# EAGLE design ControlBoardV2_PRO (EAGLE 9.6.2)
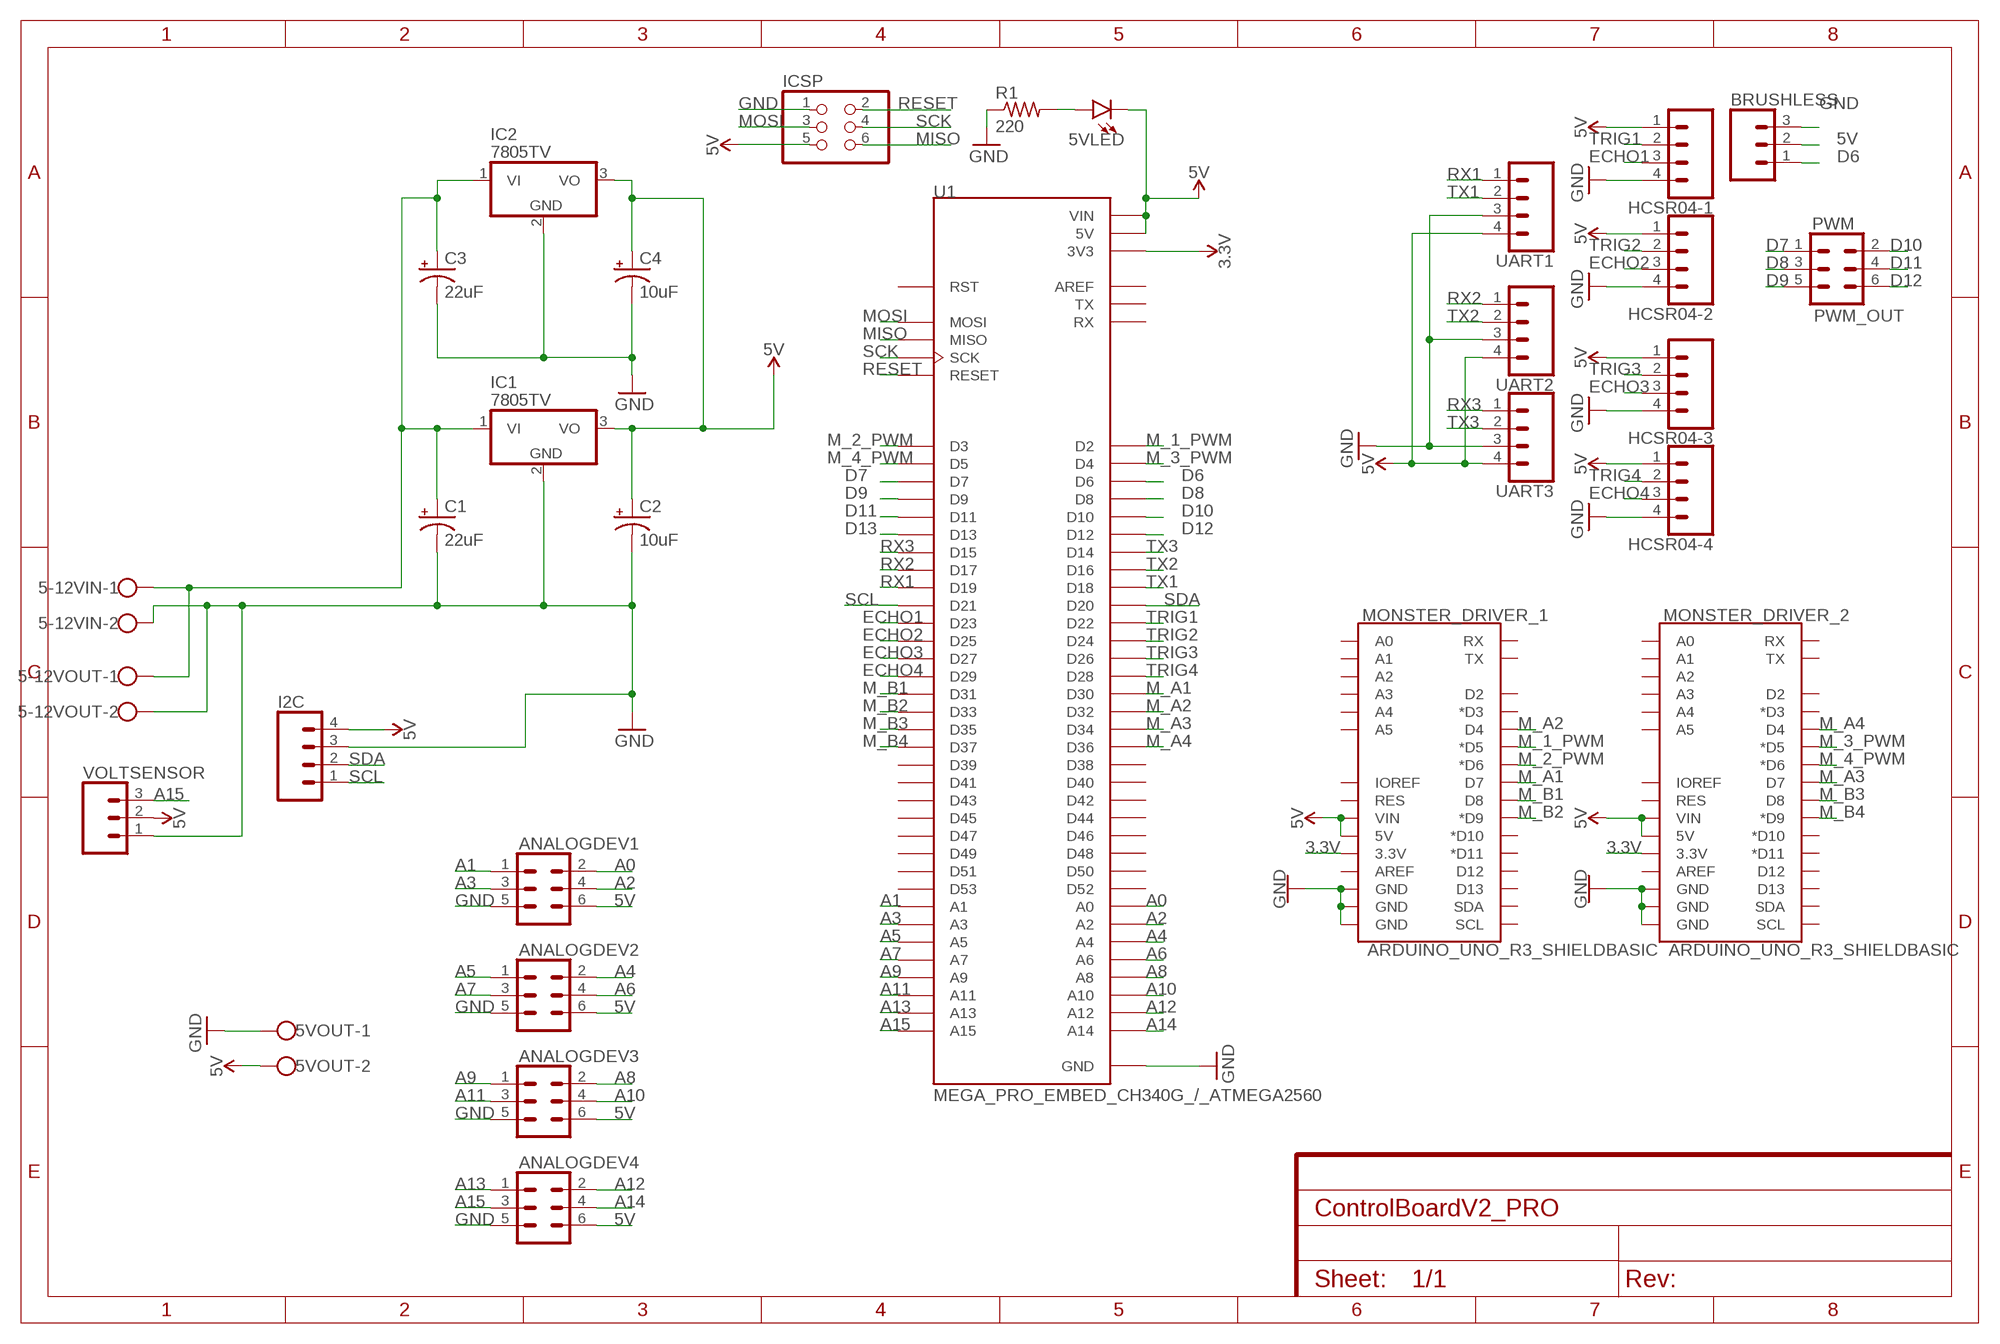
[diagram p0: schematic, sheet 1]

## Parts
5-12VIN  W237-102  [W237-102]
5-12VOUT  W237-102  [W237-102]
5VLED  LED5MM  [LED_5MM]
5VOUT  W237-102  [W237-102]
ANALOGDEV1  CONN_03X2NO_SILK  [2X3-NS]
ANALOGDEV2  CONN_03X2NO_SILK  [2X3-NS]
ANALOGDEV3  CONN_03X2NO_SILK  [2X3-NS]
ANALOGDEV4  CONN_03X2NO_SILK  [2X3-NS]
BRUSHLESS  CONN_03  [1X03]
C1  22uF  CPOL-USE2.5-5  [E2,5-5]
C2  10uF  CPOL-USE2.5-5  [E2,5-5]
C3  22uF  CPOL-USE2.5-5  [E2,5-5]
C4  10uF  CPOL-USE2.5-5  [E2,5-5]
HCSR04-1  CONN_04  [1X04]
HCSR04-2  CONN_04  [1X04]
HCSR04-3  CONN_04  [1X04]
HCSR04-4  CONN_04  [1X04]
I2C  CONN_04  [1X04]
IC1  7805TV  [TO220V]
IC2  7805TV  [TO220V]
ICSP  PINHD-2X3  [2X03]
MONSTER_DRIVER_1  ARDUINO_UNO_R3_SHIELDBASIC  [UNO_R3_SHIELD]
MONSTER_DRIVER_2  ARDUINO_UNO_R3_SHIELDBASIC  [UNO_R3_SHIELD]
PWM  PWM_OUT  CONN_03X2FEMALE  [2X3]
R1  220  R-US_0204/7  [0204/7]
U1  MEGA_PRO_EMBED_CH340G_/_ATMEGA2560  [MODULE_MEGA_PRO_EMBED_CH340G_/_ATMEGA2560]
UART1  CONN_04  [1X04]
UART2  CONN_04  [1X04]
UART3  CONN_04  [1X04]
VOLTSENSOR  CONN_03  [1X03]

## Nets
3.3V: MONSTER_DRIVER_1.3.3V MONSTER_DRIVER_2.3.3V U1.3V3_1(3V3) U1.3V3_2(3V3)
5V: 5VLED.K(C) 5VOUT.2 ANALOGDEV1.6 ANALOGDEV2.6 ANALOGDEV3.6 ANALOGDEV4.6 BRUSHLESS.2 C2.+ C4.+ HCSR04-1.1 HCSR04-2.1 HCSR04-3.1 HCSR04-4.1 I2C.4 IC1.3(VO) IC2.3(VO) ICSP.5 MONSTER_DRIVER_1.5V MONSTER_DRIVER_1.VIN MONSTER_DRIVER_2.5V MONSTER_DRIVER_2.VIN U1.5V_1(5V) U1.5V_2(5V) U1.5V_3(5V) U1.VIN_1(VIN) U1.VIN_2(VIN) UART1.4 UART2.4 UART3.4 VOLTSENSOR.2
A0: ANALOGDEV1.2 U1.A0
A1: ANALOGDEV1.1 U1.A1
A2: ANALOGDEV1.4 U1.A2
A3: ANALOGDEV1.3 U1.A3
A4: ANALOGDEV2.2 U1.A4
A5: ANALOGDEV2.1 U1.A5
A6: ANALOGDEV2.4 U1.A6
A7: ANALOGDEV2.3 U1.A7
A8: ANALOGDEV3.2 U1.A8
A9: ANALOGDEV3.1 U1.A9
A10: ANALOGDEV3.4 U1.A10
A11: ANALOGDEV3.3 U1.A11
A12: ANALOGDEV4.2 U1.A12
A13: ANALOGDEV4.1 U1.A13
A14: ANALOGDEV4.4 U1.A14
A15: ANALOGDEV4.3 U1.A15 VOLTSENSOR.3
D6: BRUSHLESS.1 U1.D6
D7: PWM.1 U1.D7
D8: PWM.3 U1.D8
D9: PWM.5 U1.D9
D10: PWM.2 U1.D10
D11: PWM.4 U1.D11
D12: PWM.6 U1.D12
D13: U1.D13
ECHO1: HCSR04-1.3 U1.D23
ECHO2: HCSR04-2.3 U1.D25
ECHO3: HCSR04-3.3 U1.D27
ECHO4: HCSR04-4.3 U1.D29
GND: 5-12VIN.2 5-12VOUT.2 5VOUT.1 ANALOGDEV1.5 ANALOGDEV2.5 ANALOGDEV3.5 ANALOGDEV4.5 BRUSHLESS.3 C1.- C2.- C3.- C4.- HCSR04-1.4 HCSR04-2.4 HCSR04-3.4 HCSR04-4.4 I2C.3 IC1.2(GND) IC2.2(GND) ICSP.1 MONSTER_DRIVER_1.GND@0(GND) MONSTER_DRIVER_1.GND@1(GND) MONSTER_DRIVER_1.GND@2(GND) MONSTER_DRIVER_2.GND@0(GND) MONSTER_DRIVER_2.GND@1(GND) MONSTER_DRIVER_2.GND@2(GND) R1.1 U1.GND_1(GND) U1.GND_2(GND) U1.GND_3(GND) UART1.3 UART2.3 UART3.3 VOLTSENSOR.1
M_1_PWM: MONSTER_DRIVER_1.D5(*D5) U1.D2
M_2_PWM: MONSTER_DRIVER_1.D6(*D6) U1.D3
M_3_PWM: MONSTER_DRIVER_2.D5(*D5) U1.D4
M_4_PWM: MONSTER_DRIVER_2.D6(*D6) U1.D5
M_A1: MONSTER_DRIVER_1.D7 U1.D30
M_A2: MONSTER_DRIVER_1.D4 U1.D32
M_A3: MONSTER_DRIVER_2.D7 U1.D34
M_A4: MONSTER_DRIVER_2.D4 U1.D36
M_B1: MONSTER_DRIVER_1.D8 U1.D31
M_B2: MONSTER_DRIVER_1.D9(*D9) U1.D33
M_B3: MONSTER_DRIVER_2.D8 U1.D35
M_B4: MONSTER_DRIVER_2.D9(*D9) U1.D37
MISO: ICSP.6 U1.MISO
MOSI: ICSP.3 U1.MOSI
N$2: 5VLED.A R1.2
N$11: 5-12VIN.1 5-12VOUT.1 C1.+ C3.+ IC1.1(VI) IC2.1(VI)
RESET: ICSP.2 U1.RESET
RX1: U1.D19 UART1.1
RX2: U1.D17 UART2.1
RX3: U1.D15 UART3.1
SCK: ICSP.4 U1.SCK
SCL: I2C.1 U1.D21
SDA: I2C.2 U1.D20
TRIG1: HCSR04-1.2 U1.D22
TRIG2: HCSR04-2.2 U1.D24
TRIG3: HCSR04-3.2 U1.D26
TRIG4: HCSR04-4.2 U1.D28
TX1: U1.D18 UART1.2
TX2: U1.D16 UART2.2
TX3: U1.D14 UART3.2
Unconnected: MONSTER_DRIVER_1.A0 MONSTER_DRIVER_1.A1 MONSTER_DRIVER_1.A2 MONSTER_DRIVER_1.A3 MONSTER_DRIVER_1.A4 MONSTER_DRIVER_1.A5 MONSTER_DRIVER_1.AREF MONSTER_DRIVER_1.D2 MONSTER_DRIVER_1.D3(*D3) MONSTER_DRIVER_1.D10(*D10) MONSTER_DRIVER_1.D11(*D11) MONSTER_DRIVER_1.D12 MONSTER_DRIVER_1.D13 MONSTER_DRIVER_1.IOREF MONSTER_DRIVER_1.RES MONSTER_DRIVER_1.RX MONSTER_DRIVER_1.SCL MONSTER_DRIVER_1.SDA MONSTER_DRIVER_1.TX MONSTER_DRIVER_2.A0 MONSTER_DRIVER_2.A1 MONSTER_DRIVER_2.A2 MONSTER_DRIVER_2.A3 MONSTER_DRIVER_2.A4 MONSTER_DRIVER_2.A5 MONSTER_DRIVER_2.AREF MONSTER_DRIVER_2.D2 MONSTER_DRIVER_2.D3(*D3) MONSTER_DRIVER_2.D10(*D10) MONSTER_DRIVER_2.D11(*D11) MONSTER_DRIVER_2.D12 MONSTER_DRIVER_2.D13 MONSTER_DRIVER_2.IOREF MONSTER_DRIVER_2.RES MONSTER_DRIVER_2.RX MONSTER_DRIVER_2.SCL MONSTER_DRIVER_2.SDA MONSTER_DRIVER_2.TX U1.AREF U1.D38 U1.D39 U1.D40 U1.D41 U1.D42 U1.D43 U1.D44 U1.D45 U1.D46 U1.D47 U1.D48 U1.D49 U1.D50 U1.D51 U1.D52 U1.D53 U1.RST U1.RX U1.TX

## Library data of the parts
5-12VIN 5-12VOUT 5VOUT = con-wago-500:W237-102: WAGO SCREW CLAMP; MPN: 237-102; OC_FARNELL: unknown; OC_NEWARK: 70K9898
5VLED = SparkFun-LED:LED: LED (Generic) Standard schematic elements and footprints for 5mm, 3mm, 1206, and 0603 sized LEDs. Generic LEDs with no color specified.
ANALOGDEV1-ANALOGDEV4 = SparkFun-Connectors:CONN_03X2: Multi connection point. Often used as Generic Header-pin footprint for 0.1 inch spaced/style header connections You can populate with any combo of single row headers, but if you'd like an exact match, check these: Header - 2x3 (Male, 0.1") <https://www.sparkfun.com/products/12807> (PRT-12807) Header - 2x3 (Female, 0.1") <https://www.sparkfun.com/products/13010> (PRT-13010) 2x3 Pin Shrouded Header <https://www.sparkfun.com/products/10877> (PRT-10877) On any of the 0.1 inch spaced packages, you can populate with these: Break Away Headers - Straight <https://www.sparkfun.com/products/116> (PRT-00116) Break Away Male Headers - Right Angle <https://www.sparkfun.com/products/553> (PRT-00553) Female Headers <https://www.sparkfun.com/products/115> (PRT-00115) Break Away Headers - Machine Pin <https://www.sparkfun.com/products/117> (PRT-00117) Break Away Female Headers - Swiss Machine Pin <https://www.sparkfun.com/products/743> (PRT-00743) Special note: the shrouded connector mates well with our 3x2 ribbon cables: Ribbon Crimp Connector - 6-pin (2x3, Female) <https://www.sparkfun.com/products/10651> (PRT-10651) Ribbon Cable - 6 wire (15ft) <https://www.sparkfun.com/products/10646> (PRT-10646)
BRUSHLESS = SparkFun-Connectors:CONN_03: Multi connection point. Often used as Generic Header-pin footprint for 0.1 inch spaced/style header connections On any of the 0.1 inch spaced packages, you can populate with these: Break Away Headers - Straight <https://www.sparkfun.com/products/116> (PRT-00116) Break Away Male Headers - Right Angle <https://www.sparkfun.com/products/553> (PRT-00553) Female Headers <https://www.sparkfun.com/products/115> (PRT-00115) Break Away Headers - Machine Pin <https://www.sparkfun.com/products/117> (PRT-00117) Break Away Female Headers - Swiss Machine Pin <https://www.sparkfun.com/products/743> (PRT-00743) Stackable Header - 3 Pin (Female, 0.1") <https://www.sparkfun.com/products/13875> (PRT-13875) For SCREWTERMINALS and SPRING TERMINALS visit here: Screw Terimnals on SparkFun.com <https://www.sparkfun.com/search/results?term=Screw+Terminals> (5mm/3.5mm/2.54mm spacing) This device is also useful as a general connection point to wire up your design to another part of your project. Our various solder wires solder well into these plated through hole pads. Hook-Up Wire - Assortment (Stranded, 22 AWG) <https://www.sparkfun.com/products/11375> (PRT-11375) Hook-Up Wire - Assortment (Solid Core, 22 AWG) <https://www.sparkfun.com/products/11367> (PRT-11367) View the entire wire category on our website here <https://www.sparkfun.com/categories/141> Special notes: Molex polarized connector foot print use with SKU : PRT-08232 with associated crimp pins and housings.; PROD_ID: XXX-00000; VALUE: 455-1750-1-ND
C1-C4 = adafruit:CPOL-US: POLARIZED CAPACITOR, American symbol
HCSR04-1-HCSR04-4 I2C UART1-UART3 = SparkFun-Connectors:CONN_04: Multi connection point. Often used as Generic Header-pin footprint for 0.1 inch spaced/style header connections On any of the 0.1 inch spaced packages, you can populate with these: Break Away Headers - Straight <https://www.sparkfun.com/products/116> (PRT-00116) Break Away Male Headers - Right Angle <https://www.sparkfun.com/products/553> (PRT-00553) Female Headers <https://www.sparkfun.com/products/115> (PRT-00115) Break Away Headers - Machine Pin <https://www.sparkfun.com/products/117> (PRT-00117) Break Away Female Headers - Swiss Machine Pin <https://www.sparkfun.com/products/743> (PRT-00743) For SCREWTERMINALS and SPRING TERMINALS visit here: Screw Terimnals on SparkFun.com <https://www.sparkfun.com/search/results?term=Screw+Terminals> (5mm/3.5mm/2.54mm spacing) This device is also useful as a general connection point to wire up your design to another part of your project. Our various solder wires solder well into these plated through hole pads. Hook-Up Wire - Assortment (Stranded, 22 AWG) <https://www.sparkfun.com/products/11375> (PRT-11375) Hook-Up Wire - Assortment (Solid Core, 22 AWG) <https://www.sparkfun.com/products/11367> (PRT-11367) View the entire wire category on our website here <https://www.sparkfun.com/categories/141> Special notes: Molex polarized connector foot print use with SKU : PRT-08231 with associated crimp pins and housings. 1MM SMD Version SKU: PRT-10208; PROD_ID: CONN-09696
IC1 IC2 = linear:78*: Positive VOLTAGE REGULATOR Source: http://cache.national.com/ds/LM/LM78L05.pdf http://www.fairchildsemi.com/ds/LM/LM7805.pdf
ICSP = pinhead:PINHD-2X3: PIN HEADER
MONSTER_DRIVER_1 MONSTER_DRIVER_2 = SparkFun-Boards:ARDUINO_UNO_R3_SHIELD: Arduino R3 Shield Footprint Shield form compatible with the Arduino Uno R3. SparkFun Products: MG2639 Cellular Shield <https://www.sparkfun.com/products/13120> MIDI Shield <https://www.sparkfun.com/products/12898> R3 Stackable Headers Kit <https://www.sparkfun.com/products/11417>
PWM = SparkFun-Connectors:CONN_03X2: Multi connection point. Often used as Generic Header-pin footprint for 0.1 inch spaced/style header connections You can populate with any combo of single row headers, but if you'd like an exact match, check these: Header - 2x3 (Male, 0.1") <https://www.sparkfun.com/products/12807> (PRT-12807) Header - 2x3 (Female, 0.1") <https://www.sparkfun.com/products/13010> (PRT-13010) 2x3 Pin Shrouded Header <https://www.sparkfun.com/products/10877> (PRT-10877) On any of the 0.1 inch spaced packages, you can populate with these: Break Away Headers - Straight <https://www.sparkfun.com/products/116> (PRT-00116) Break Away Male Headers - Right Angle <https://www.sparkfun.com/products/553> (PRT-00553) Female Headers <https://www.sparkfun.com/products/115> (PRT-00115) Break Away Headers - Machine Pin <https://www.sparkfun.com/products/117> (PRT-00117) Break Away Female Headers - Swiss Machine Pin <https://www.sparkfun.com/products/743> (PRT-00743) Special note: the shrouded connector mates well with our 3x2 ribbon cables: Ribbon Crimp Connector - 6-pin (2x3, Female) <https://www.sparkfun.com/products/10651> (PRT-10651) Ribbon Cable - 6 wire (15ft) <https://www.sparkfun.com/products/10646> (PRT-10646); PROD_ID: CONN-11566; VALUE: FEMALE 2x3
R1 = adafruit:R-US_: RESISTOR, American symbol
U1 = MEGA_PRO_EMBED_CH340G___ATMEGA2560:MEGA_PRO_EMBED_CH340G_/_ATMEGA2560: Mega 2560 PRO (Embed) CH340G/ATmega2560-16AU Check availability <https://pricing.snapeda.com/parts/Mega%20Pro%20Embed%20CH340G%20/%20ATmega2560/Robotdyn/view-part?ref=eda>; AVAILABILITY: Not in stock; MF: Robotdyn; MP: Mega Pro Embed CH340G / ATmega2560; PACKAGE: None; PRICE: None
VOLTSENSOR = SparkFun-Connectors:CONN_03: Multi connection point. Often used as Generic Header-pin footprint for 0.1 inch spaced/style header connections On any of the 0.1 inch spaced packages, you can populate with these: Break Away Headers - Straight <https://www.sparkfun.com/products/116> (PRT-00116) Break Away Male Headers - Right Angle <https://www.sparkfun.com/products/553> (PRT-00553) Female Headers <https://www.sparkfun.com/products/115> (PRT-00115) Break Away Headers - Machine Pin <https://www.sparkfun.com/products/117> (PRT-00117) Break Away Female Headers - Swiss Machine Pin <https://www.sparkfun.com/products/743> (PRT-00743) Stackable Header - 3 Pin (Female, 0.1") <https://www.sparkfun.com/products/13875> (PRT-13875) For SCREWTERMINALS and SPRING TERMINALS visit here: Screw Terimnals on SparkFun.com <https://www.sparkfun.com/search/results?term=Screw+Terminals> (5mm/3.5mm/2.54mm spacing) This device is also useful as a general connection point to wire up your design to another part of your project. Our various solder wires solder well into these plated through hole pads. Hook-Up Wire - Assortment (Stranded, 22 AWG) <https://www.sparkfun.com/products/11375> (PRT-11375) Hook-Up Wire - Assortment (Solid Core, 22 AWG) <https://www.sparkfun.com/products/11367> (PRT-11367) View the entire wire category on our website here <https://www.sparkfun.com/categories/141> Special notes: Molex polarized connector foot print use with SKU : PRT-08232 with associated crimp pins and housings.

## Board
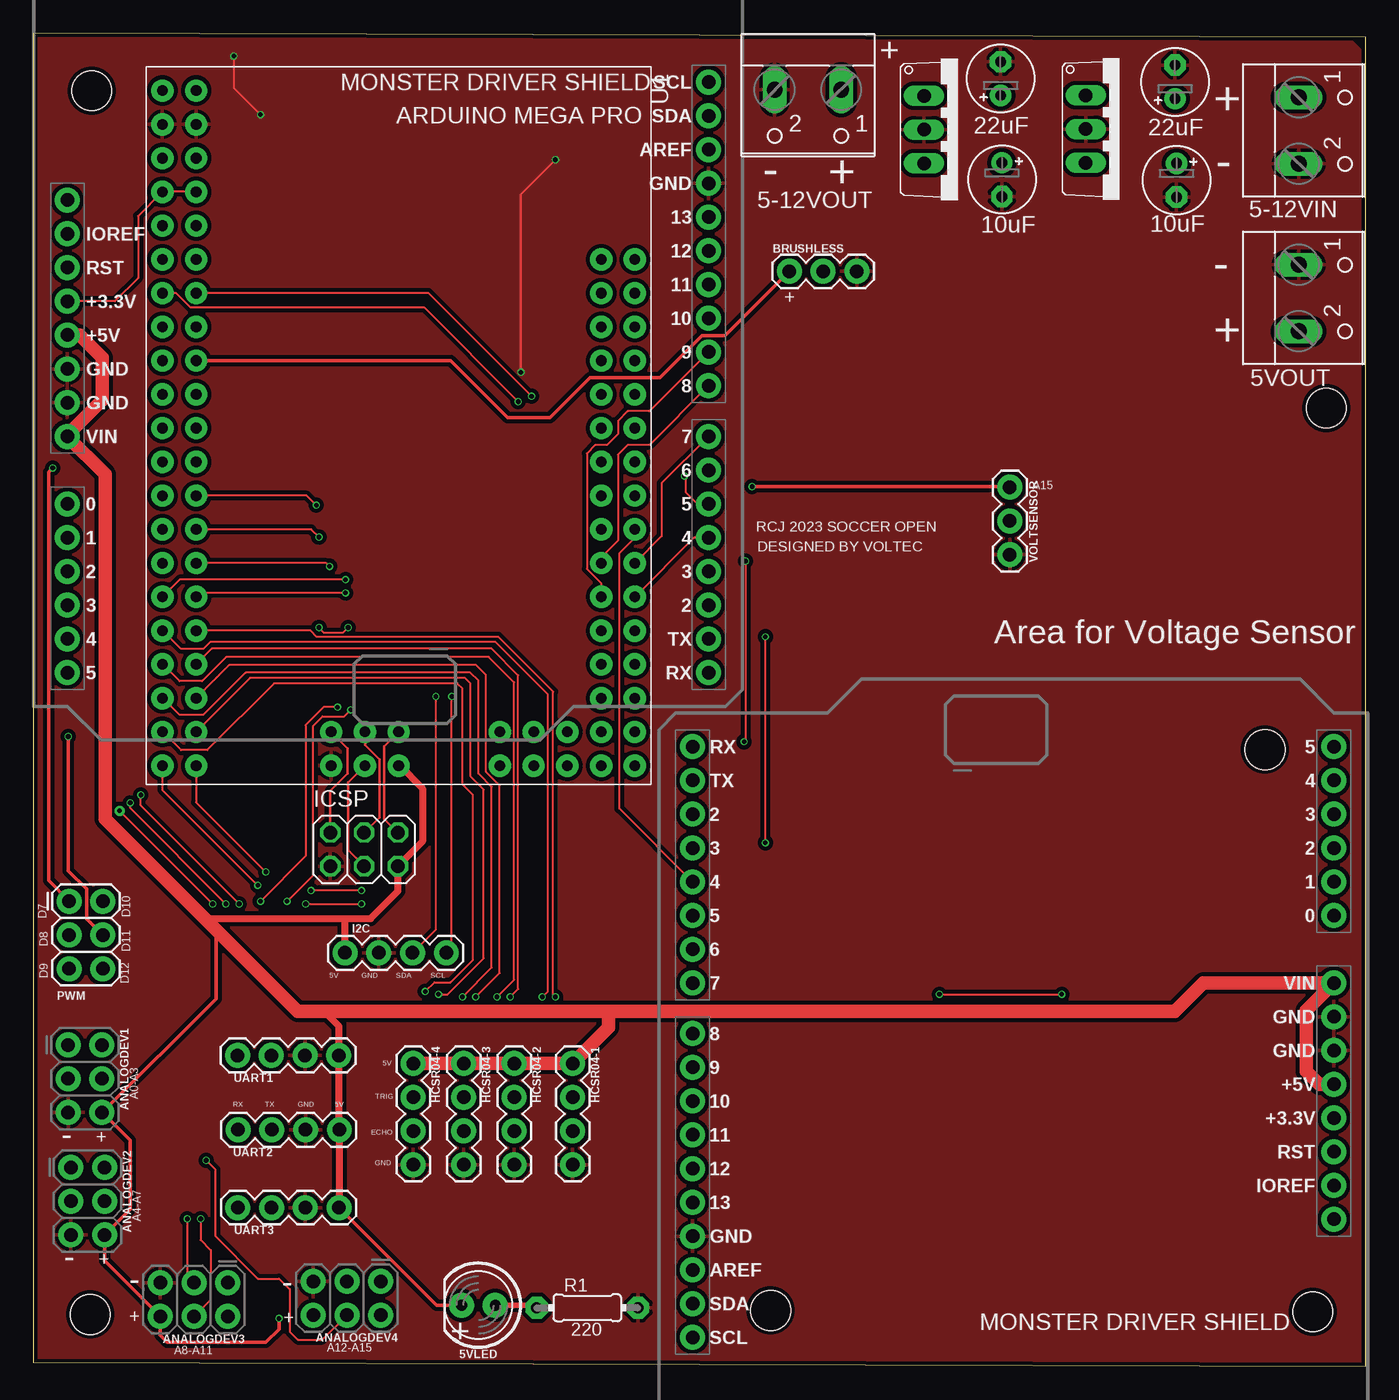
[diagram p1: board, top side]
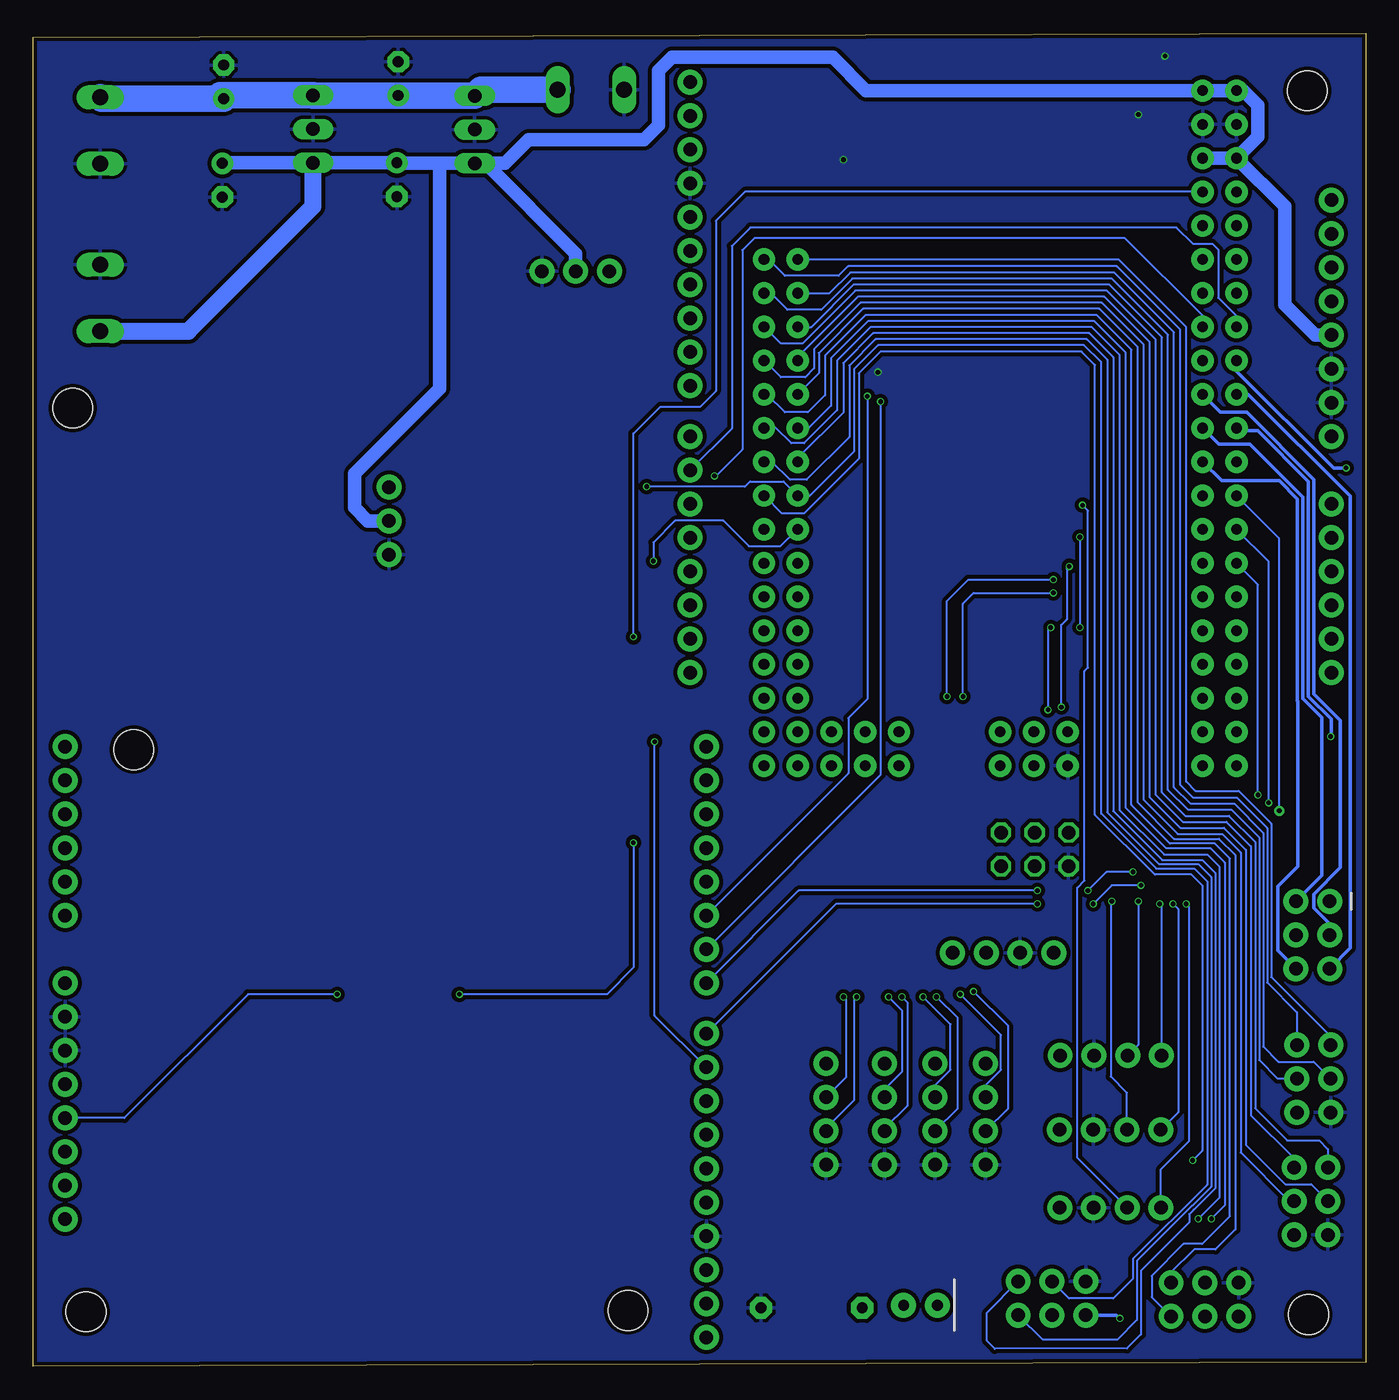
[diagram p2: board, bottom side, seen from below]

Size 100.27 x 100.32 mm. Coordinates in mm from the lower left corner, seen from the top.
Outline: 0,0.3 100.27,0 100.27,100.02 0,100.32 0,0.3
Copper layers (1*16): Top 0.035559375mm / dielectric 1.6mm / Bottom 0.035559375mm
Design rules "jlcpcb2layer": minimum track width 5mil, minimum drill 12mil, track to track 5mil, track to pad 5mil, pad to pad 5mil, via to via 5mil, smd to smd 5mil, copper to edge 8mil, drill to drill 6mil, minimum pad ring 5mil, minimum via ring 3mil, stop-mask expansion 2.5mil, vias tented up to drill 0mil, thermal gap 10mil
Holes 3 mm at 4.4,96 96.3,4.1 55.5,4.2 92.7,46.4 4.3,3.9 97.3,72.1

### Footprints (pad centres in the part's own frame; a part is rotated, then mirrored left to right if it is on the bottom)
W237-102 = drill 1.194 long: 1 -2.5,-1.27; 2 2.5,-1.27
LED_5MM = drill 0.813 pad 1.88: A -1.27,0; K 1.27,0
2X3-NS = drill 1.016 pad 1.88: 1 -2.54,-1.27; 2 -2.54,1.27; 3 0,-1.27; 4 0,1.27; 5 2.54,-1.27; 6 2.54,1.27
1X03 = drill 1.016 pad 1.88: 1 0,0; 2 2.54,0; 3 5.08,0
E2,5-5 = drill 0.813 pad 1.6: + -1.27,0 | drill 0.813 pad 1.6 octagon: - 1.27,0
1X04 = drill 1.016 pad 1.88: 1 0,0; 2 2.54,0; 3 5.08,0; 4 7.62,0
TO220V = drill 1.016 long: 1 -2.54,-2.54; 2 0,-2.54; 3 2.54,-2.54
2X03 = drill 1.016 octagon: 1 -2.54,-1.27; 2 -2.54,1.27; 3 0,-1.27; 4 0,1.27; 5 2.54,-1.27; 6 2.54,1.27
UNO_R3_SHIELD = drill 1.016 pad 1.88: 3.3V 24.13,-2.54; 5V 24.13,0; A0 24.13,12.7; A1 24.13,15.24; A2 24.13,17.78; A3 24.13,20.32; A4 24.13,22.86; A5 24.13,25.4; AREF -24.13,-13.97; D2 -24.13,20.32; D3 -24.13,17.78; D4 -24.13,15.24; D5 -24.13,12.7; D6 -24.13,10.16; D7 -24.13,7.62; D8 -24.13,3.81; D9 -24.13,1.27; D10 -24.13,-1.27; D11 -24.13,-3.81; D12 -24.13,-6.35; D13 -24.13,-8.89; GND@0 24.13,2.54; GND@1 24.13,5.08; GND@2 -24.13,-11.43; IOREF 24.13,-7.62; NC 24.13,-10.16; RES 24.13,-5.08; RX -24.13,25.4; SCL -24.13,-19.05; SDA -24.13,-16.51; TX -24.13,22.86; VIN 24.13,7.62
2X3 = drill 1.016 pad 1.88: 1 0,0; 2 0,2.54; 3 2.54,0; 4 2.54,2.54; 5 5.08,0; 6 5.08,2.54
0204/7 = drill 0.813 pad 1.676 octagon: 1 -3.81,0; 2 3.81,0
MODULE_MEGA_PRO_EMBED_CH340G_/_ATMEGA2560 = drill 0.8 pad 1.676: 3V3_1 -17.58,-17.78; 3V3_2 -17.58,-15.24; 5V_1 -20.12,-17.78; 5V_2 -20.12,-15.24; 5V_3 25.6,0; A0 -12.5,17.78; A1 -12.5,15.24; A2 -9.96,17.78; A3 -9.96,15.24; A4 -7.42,17.78; A5 -7.42,15.24; A6 -4.88,17.78; A7 -4.88,15.24; A8 -2.34,17.78; A9 -2.34,15.24; A10 0.2,17.78; A11 0.2,15.24; A12 2.74,17.78; A13 2.74,15.24; A14 5.28,17.78; A15 5.28,15.24; AREF -15.04,-15.24; D2 -9.96,-15.24; D3 -9.96,-17.78; D4 -7.42,-15.24; D5 -7.42,-17.78; D6 -4.88,-15.24; D7 -4.88,-17.78; D8 -2.34,-15.24; D9 -2.34,-17.78; D10 0.2,-15.24; D11 0.2,-17.78; D12 2.74,-15.24; D13 2.74,-17.78; D14 5.28,-15.24; D15 5.28,-17.78; D16 7.82,-15.24; D17 7.82,-17.78; D18 10.36,-15.24; D19 10.36,-17.78; D20 12.9,-15.24; D21 12.9,-17.78; D22 15.44,-15.24; D23 15.44,-17.78; D24 17.98,-15.24; D25 17.98,-17.78; D26 20.52,-15.24; D27 20.52,-17.78; D28 23.06,-15.24; D29 23.06,-17.78; D30 25.6,-15.24; D31 25.6,-17.78; D32 7.82,17.78; D33 7.82,15.24; D34 10.36,17.78; D35 10.36,15.24; D36 12.9,17.78; D37 12.9,15.24; D38 15.44,17.78; D39 15.44,15.24; D40 17.98,17.78; D41 17.98,15.24; D42 20.52,17.78; D43 20.52,15.24; D44 23.06,17.78; D45 23.06,15.24; D46 25.6,17.78; D47 25.6,15.24; D48 25.6,12.7; D49 23.06,12.7; D50 25.6,10.16; D51 23.06,10.16; D52 25.6,7.62; D53 23.06,7.62; GND_1 -22.66,-17.78; GND_2 -22.66,-15.24; GND_3 25.6,-5.08; MISO 23.06,0; MOSI 25.6,-2.54; RESET 23.06,-5.08; RST -15.04,-17.78; RX -12.5,-15.24; SCK 23.06,-2.54; TX -12.5,-17.78; VIN_1 -25.2,-17.78; VIN_2 -25.2,-15.24

### Placement (x,y rotation side)
5-12VIN  96.5,93 270 top
5-12VOUT  58.3,94.8 180 top
5VLED  33.5,4.6 180 top
5VOUT  96.5,80.4 270 top
ANALOGDEV1  3.9,21.64 270 top
ANALOGDEV2  4.1,12.43 270 top
ANALOGDEV3  12.1,5.02 180 top
ANALOGDEV4  23.61,5.12 180 top
BRUSHLESS  56.9,82.4 0 top
C1  85.93,96.66 90 top
C2  86.04,89.26 270 top
C3  72.8,96.9 90 top
C4  72.9,89.3 270 top
HCSR04-1  40.6,22.79 270 top
HCSR04-2  36.2,22.79 270 top
HCSR04-3  32.4,22.79 270 top
HCSR04-4  28.6,22.79 270 top
I2C  31.09,31.11 180 top
IC1  81.75,93.11 270 top
IC2  69.58,93.07 270 top
ICSP  24.9,38.9 0 top
MONSTER_DRIVER_1  73.75,21.23 0 top
MONSTER_DRIVER_2  26.7,77.6 180 top
PWM  2.7,35 270 top
R1  41.7,4.4 180 top
U1  27.5,70.8 270 top
UART1  15.37,23.39 0 top
UART2  15.42,17.8 0 top
UART3  15.4,11.94 0 top
VOLTSENSOR  73.49,61.07 90 top

### Tracks (layer width: path | path; a pad name or v marks a point on that pad's centre or on a via)
3.3V  (via drill 0.35)
  Top 0.152: U1.3V3_2 U1.3V3_1 7.9,86.56 7.9,81.9 6.14,80.14 MONSTER_DRIVER_2.3.3V | v55.1,39.4 v55.1,54.9 | v68.2,28 v77.4,28
  Bottom 0.152: MONSTER_DRIVER_1.3.3V 93.41,18.69 84.1,28 v77.4,28 | U1.3V3_2 46.72,88.38 48.9,86.2 48.9,73.4 50.1,72.2 53.1,72.2 55.1,70.2 v55.1,54.9 | v55.1,39.4 55.1,30 57.1,28 v68.2,28
5V  (via drill 0.35)
  Top 0.254: UART3.4 30.36,4.6 5VLED.K | v18.5,3.6 18.5,2.8 17.5,1.8 10.1,1.8 9.56,2.34 ANALOGDEV3.6 5.37,7.94 ANALOGDEV2.6 7.3,11.82 7.3,17 5.2,19.1 | 5.2,19.1 ANALOGDEV1.6 | 5.2,19.1 13.75,27.65 13.75,32.85
  Top 0.508: 12.9,33.7 23.47,33.7 | 23.47,33.7 25.4,33.7 27.44,35.74 ICSP.5 29.3,39.49 29.3,43.5 27.6,45.2 | I2C.4 23.47,33.7 | 21.9,26.7 22.99,25.61 UART1.4 22.99,17.85 UART2.4 23.04,11.96 UART3.4
  Top 1.016: 27.6,45.2 U1.5V_3 | MONSTER_DRIVER_1.5V 96.77,21.23 95.8,22.2 95.8,26.77 MONSTER_DRIVER_1.VIN 88.05,28.85 85.9,26.7 43.3,26.7 | 43.3,26.7 21.9,26.7 19.9,26.7 13.75,32.85 12.9,33.7 5.4,41.2 5.4,67.15 MONSTER_DRIVER_2.VIN 2.57,70.07 5.2,72.7 5.2,75.9 3.5,77.6 MONSTER_DRIVER_2.5V | HCSR04-4.1 HCSR04-3.1 HCSR04-2.1 HCSR04-1.1 43.3,25.49 43.3,26.7
  Bottom 0.254: IC2.3 66.23,90.53 | v18.5,3.6 18.75,3.85 ANALOGDEV4.6
  Bottom 1.016: 69.69,90.53 IC2.3 64.77,90.53 63,92.3 54.3,92.3 53.2,93.4 53.2,97.5 52.2,98.5 40.1,98.5 37.6,96 U1.VIN_2 U1.VIN_1 9.2,96 8.1,94.9 8.1,92.54 U1.5V_1 | C2.+ 86,90.57 IC1.3 C4.+ 72.86,90.53 69.69,90.53 | U1.5V_1 U1.5V_2 | U1.5V_1 6.1,87.3 6.1,79.9 3.8,77.6 MONSTER_DRIVER_2.5V | VOLTSENSOR.2 75.09,63.61 76.09,64.61 76.09,67.17 69.69,73.57 69.69,90.53 | 66.23,90.53 59.44,83.74 BRUSHLESS.2
  Bottom 1.27: 5VOUT.2 88.6,77.9 79.21,87.29 IC1.3
A0
  Bottom 0.152: U1.A0 44.96,83.3 43.71,82.06 39.67,82.06 38.95,82.78 18.72,82.78 13.96,78.01 13.96,43.76 13,42.8 9.7,42.8 7.41,40.51 7.41,28.87 5.17,26.64 ANALOGDEV1.2
A1
  Bottom 0.152: U1.A1 18.6,83.3 13.5,78.2 13.5,44 12.8,43.3 9.55,43.3 7.1,40.85 7.1,29.3 2.63,24.83 ANALOGDEV1.1
A2
  Bottom 0.152: U1.A2 44.76,80.76 43.51,79.52 40.97,79.52 38.62,81.86 19.1,81.86 14.87,77.63 14.87,43.38 13.38,41.89 10.09,41.89 8.01,39.81 8.01,23.04 6.61,21.64 ANALOGDEV1.4
A3
  Bottom 0.152: U1.A3 40.34,80.76 38.78,82.32 18.91,82.32 14.42,77.82 14.42,43.57 13.19,42.34 9.9,42.34 7.71,40.15 7.71,24.07 6.55,22.91 3.9,22.91 ANALOGDEV1.3
A4
  Bottom 0.152: U1.A4 45.26,78.22 44.01,76.98 42.37,76.98 38.4,80.95 19.48,80.95 15.79,77.25 15.79,43 13.76,40.97 10.47,40.97 8.62,39.13 8.62,18.89 5.37,15.64 ANALOGDEV2.2
A5
  Bottom 0.152: U1.A5 41.72,78.22 38.53,81.41 19.29,81.41 15.33,77.44 15.33,43.19 13.57,41.43 10.28,41.43 8.32,39.47 8.32,19.42 5.9,17 3.5,17 2.83,16.33 ANALOGDEV2.1
A6
  Bottom 0.152: U1.A6 45.26,75.68 44.01,74.44 42.17,74.44 41.5,75.11 41.5,76.55 38.02,80.03 19.86,80.03 16.7,76.88 16.7,42.62 14.14,40.06 10.8,40.06 9.4,38.66 9.4,16.1 5.73,12.43 ANALOGDEV2.4
A7
  Bottom 0.152: U1.A7 42.74,75.96 38.21,80.49 19.67,80.49 16.25,77.06 16.25,42.81 13.95,40.51 10.66,40.51 9.01,38.86 9.01,16.65 6.05,13.7 4.1,13.7 ANALOGDEV2.3
A8
  Bottom 0.152: U1.A8 45.06,73.14 43.71,71.8 41.97,71.8 40.68,73.08 40.68,76.08 37.64,79.12 20.24,79.12 17.62,76.5 17.62,42.24 14.71,39.34 11.34,39.34 10.21,38.21 10.21,11.29 12.3,9.2 13.7,9.2 16.1,6.8 16.1,5.21 ANALOGDEV3.2
A9
  Bottom 0.152: U1.A9 41.14,74.74 41.14,76.26 37.83,79.58 20.05,79.58 17.16,76.69 17.16,42.43 14.43,39.7 11.04,39.7 9.8,38.46 9.8,10.3 11.3,8.8 12.9,8.8 14.64,7.06 ANALOGDEV3.1
A10  (via drill 0.35)
  Top 0.152: v12.6,11.1 12.6,9.5 13.37,8.73 13.37,5.02 ANALOGDEV3.4
  Bottom 0.152: U1.A10 44.36,70.6 43.21,69.46 42.27,69.46 39.77,71.95 39.77,75.7 37.26,78.2 20.62,78.2 18.53,76.12 18.53,41.87 15.17,38.5 11.9,38.5 11.01,37.6 11.01,12.7 v12.6,11.1
A11  (via drill 0.35)
  Top 0.152: v11.6,11.1 11.6,6.79 ANALOGDEV3.3
  Bottom 0.152: U1.A11 41.92,70.6 40.22,72.29 40.22,75.89 37.45,78.66 20.43,78.66 18.07,76.31 18.07,42.05 15.02,39 11.7,39 10.6,37.9 10.6,12.1 v11.6,11.1
A12
  Bottom 0.152: U1.A12 44.66,68.06 43.31,66.72 42.07,66.72 38.85,69.93 38.85,75.32 36.88,77.29 21,77.29 19.45,75.74 19.45,41.69 15.55,37.8 12.6,37.8 11.62,36.82 11.62,13.52 13.05,12.09 13.07,12.09 17.21,7.95 17.21,3.5 18.7,2 24.3,2 ANALOGDEV4.2
A13
  Bottom 0.152: U1.A13 42.74,68.34 39.31,71.77 39.31,75.51 37.07,77.75 20.81,77.75 18.99,75.93 18.99,41.78 15.31,38.1 12.3,38.1 11.31,37.11 11.31,13.4 12.93,11.78 12.94,11.78 13.28,11.44 13.28,10.82 16.9,7.2 16.9,2.4 17.96,1.34 27.9,1.31 28.5,1.91 28.5,4.04 ANALOGDEV4.1
A14  (via drill 0.35)
  Top 0.152: v13.02,15.5 13.7,14.82 13.7,9.8 16.9,6.6 18.5,6.6 19.3,5.8 19.3,2.6 19.9,2 21.76,2 ANALOGDEV4.4
  Bottom 0.152: U1.A14 45.26,65.52 43.91,64.18 42.27,64.18 38.14,68.3 38.14,74.74 36.5,76.38 21.38,76.38 20.36,75.36 20.36,41.51 15.85,37 13.1,37 12.3,36.2 12.3,16.22 v13.02,15.5
A15  (via drill 0.35)
  Top 0.254: v54.1,66.2 73.44,66.2 VOLTSENSOR.3
  Bottom 0.152: v54.1,66.2 46.71,66.2 46.32,66.59 43.81,66.59 U1.A15 41.82,65.52 38.5,68.84 38.5,75.03 36.69,76.83 21.19,76.83 19.9,75.55 19.9,41.6 15.75,37.45 12.88,37.45 11.93,36.49 11.93,13.66 17.51,8.07 17.51,6.59 19,5.1 22.32,5.1 ANALOGDEV4.3
D6
  Top 0.254: U1.D6 31.42,75.68 35.7,71.4 38.9,71.4 41.9,74.4 47.18,74.4 50.32,77.55 52.05,77.55 BRUSHLESS.1
D7  (via drill 0.35)
  Top 0.254: PWM.1 1.15,36.55 1.15,67.28 v1.47,67.6
  Bottom 0.254: U1.D7 9.72,74.91 2.41,67.6 v1.47,67.6
D8
  Bottom 0.254: U1.D8 10.92,71.8 8.96,71.8 3.9,66.75 3.9,50.6 1.9,48.6 1.9,37.52 3.92,35.51 3.92,34.49 2.7,33.28 PWM.3
D9
  Bottom 0.254: U1.D9 8.82,73.14 1.15,65.47 1.15,31.47 PWM.5
D10
  Bottom 0.254: U1.D10 11.06,69.4 8.7,69.4 4.72,65.42 4.72,50.25 3.3,48.83 3.3,36.94 PWM.2
D11  (via drill 0.35)
  Top 0.254: v2.63,47.4 2.63,37.29 4.02,35.91 4.02,33.68 PWM.4
  Bottom 0.254: U1.D11 9.52,70.4 8.13,70.4 4.31,66.58 4.31,50.41 2.6,48.7 2.6,47.43 v2.63,47.4
D12
  Bottom 0.254: U1.D12 10.84,66.64 6.51,66.64 5.13,65.25 5.13,50.08 5.1,50.05 5.1,37.6 6.6,36.1 6.6,31.28 PWM.6
ECHO1  (via drill 0.35)
  Top 0.152: U1.D23 9.75,55.36 11.12,53.99 12.8,53.99 13.31,54.5 34.8,54.5 38.73,50.57 38.73,28.23 v38.3,27.8
  Bottom 0.152: HCSR04-1.3 40.6,17.91 38.5,20.02 38.5,27.6 v38.3,27.8
ECHO2  (via drill 0.35)
  Top 0.152: v34.9,27.8 36.2,29.09 36.2,51.47 34.28,53.38 14.53,53.38 12.7,51.55 11.02,51.55 9.75,52.82 U1.D25
  Bottom 0.152: HCSR04-2.3 36.2,17.91 34.5,19.61 34.5,27.4 v34.9,27.8
ECHO3  (via drill 0.35)
  Top 0.152: v32.3,27.8 34.5,30 34.5,43.6 33.5,44.6 33.5,51.6 32.89,52.21 16,52.21 12.8,49.01 11.02,49.01 9.75,50.28 U1.D27
  Bottom 0.152: HCSR04-3.3 30.7,19.41 30.7,26.2 v32.3,27.8
ECHO4  (via drill 0.35)
  Top 0.152: U1.D29 9.75,47.74 11.12,46.37 13.1,46.37 18.13,51.4 31.9,51.4 32.3,51 32.3,43.8 33.1,43 33.1,30.6 31.4,28.9 30.2,28.9 v29.5,28.2
  Bottom 0.152: HCSR04-4.3 26.9,19.41 26.9,25.6 v29.5,28.2
GND  (via drill 0.35)
  Top 0.152: v36.7,74.8 36.7,88.2 v39.3,90.8 | v15.1,98.6 15.1,96.2 v17.1,94.2
  pour Bottom (isolate 0.305): 0.1,100.4 100.2,100.4 100.2,-0.1 0.1,-0.1
  pour Top (isolate 0.305): 0,100.1 98.8,100.1 99.9,99 99.9,0.6 100.1,0.4 0,0.4
M_1_PWM  (via drill 0.35)
  Top 0.152: U1.D2 29.74,80.76 v37.5,73
  Bottom 0.152: MONSTER_DRIVER_1.D5 38.93,44.62 38.93,48.77 37.5,50.2 v37.5,73
M_2_PWM  (via drill 0.35)
  Top 0.152: U1.D3 10.75,80.76 11.82,79.69 29.41,79.69 v36.5,72.6
  Bottom 0.152: v36.5,72.6 36.5,44.5 MONSTER_DRIVER_1.D6
M_3_PWM  (via drill 0.35)
  Top 0.152: MONSTER_DRIVER_2.D5 50,64.9 49.1,65.8 49.1,66.9 v49,67
  Bottom 0.152: U1.D4 12.26,79.05 18.1,84.9 46,84.9 46.9,84 46.9,69 48.9,67 v49,67
M_4_PWM
  Bottom 0.152: MONSTER_DRIVER_2.D6 47.7,70.57 47.7,84.3 46.3,85.7 14.23,85.7 13,84.47 11.53,84.47 11.09,84.03 11.09,80.42 9.72,79.05 U1.D5
M_A1  (via drill 0.35)
  Top 0.152: U1.D30 12.26,42.44 v17.5,37.2 | v24.7,35.8 v20.9,35.8
  Bottom 0.152: v17.5,37.2 19.5,37.2 v20.9,35.8 | v24.7,35.8 42.66,35.8 MONSTER_DRIVER_1.D7
M_A2
  Top 0.152: U1.D32 45.28,62.35 44.11,61.18 44.11,41.97 MONSTER_DRIVER_1.D4
M_A3
  Top 0.152: MONSTER_DRIVER_2.D7 47.3,66.45 47.3,62.46 U1.D34
M_A4
  Top 0.152: MONSTER_DRIVER_2.D4 49.74,62.36 U1.D36
M_B1  (via drill 0.35)
  Top 0.152: U1.D31 9.72,43.38 v16.9,36.2 | v20.5,34.8 v24.7,34.8
  Bottom 0.152: v16.9,36.2 19.1,36.2 v20.5,34.8 | v24.7,34.8 39.85,34.8 MONSTER_DRIVER_1.D8
M_B2  (via drill 0.35)
  Top 0.152: v53.6,60.6 53.6,47.1 v53.5,47
  Bottom 0.152: MONSTER_DRIVER_1.D9 53.5,26.38 v53.5,47 | U1.D33 42.77,62.98 44.04,61.71 46.42,61.71 48.34,63.63 51.97,63.63 53.6,62 v53.6,60.6
M_B3
  Top 0.152: MONSTER_DRIVER_2.D8 46.37,69.33 44.74,69.33 44.01,68.59 44.01,62.14 42.74,60.87 U1.D35
M_B4
  Top 0.152: MONSTER_DRIVER_2.D9 46.37,71.87 44.74,71.87 44.01,71.14 44.01,70.17 43.17,69.33 42.3,69.33 41.67,68.7 41.67,60 42.74,58.93 U1.D37
MISO
  Top 0.2: ICSP.6 26.4,41.21 26.4,46.64 U1.MISO
MOSI
  Top 0.2: ICSP.3 23.69,38.85 23.69,43.93 U1.MOSI
N$2
  Top 0.406: 5VLED.A 37.69,4.6 R1.2
N$11
  Bottom 2: 5-12VIN.1 95.12,95.39 C1.+ 86.19,95.65 IC1.1 79.19,95.63 C3.+ 72.78,95.61 IC2.1 66.58,96.07 5-12VOUT.1
RESET
  Top 0.2: ICSP.2 22.36,43.31 23.65,44.6 23.65,46.51 U1.RESET
RX1  (via drill 0.35)
  Top 0.152: v15.5,34.8 8.1,42.2 v8.1,43
  Bottom 0.152: v8.1,43 8.1,58.82 U1.D19 | v15.5,34.8 15.37,34.67 UART1.1
RX2  (via drill 0.35)
  Top 0.152: v14.5,34.8 7.3,42 v7.3,42.4
  Bottom 0.152: UART2.1 14.1,19.12 14.1,34.4 v14.5,34.8 | v7.3,42.4 7.3,60.56 U1.D17
RX3  (via drill 0.35, 0.35 pad 0.75)
  Top 0.152: v13.5,34.8 v6.5,41.8
  Bottom 0.152: UART3.1 15.4,14.84 13.3,16.94 13.3,34.6 v13.5,34.8 | v6.5,41.8 6.5,62.3 U1.D15
SCK
  Top 0.2: U1.SCK 24.96,46.74 26.05,45.65 26.05,41.32 ICSP.4
SCL  (via drill 0.35)
  Top 0.152: I2C.1 31.5,31.52 v31.5,50.4 | v23.5,59.2 11.02,59.2 U1.D21
  Bottom 0.152: v31.5,50.4 31.5,57.6 29.9,59.2 v23.5,59.2
SDA  (via drill 0.35)
  Top 0.152: I2C.2 30.3,32.86 v30.3,50.4 | v23.5,58.2 12.56,58.2 U1.D20
  Bottom 0.152: v30.3,50.4 30.3,57.4 29.5,58.2 v23.5,58.2
TRIG1  (via drill 0.35)
  Top 0.152: U1.D22 20.88,55.36 21.35,54.9 35,54.9 39.13,50.77 39.13,27.97 v39.3,27.8
  Bottom 0.152: HCSR04-1.2 39.1,21.75 39.1,27.6 v39.3,27.8
TRIG2  (via drill 0.35)
  Top 0.152: v35.9,27.8 36.5,28.4 36.5,52 34.5,54 13.44,54 U1.D24
  Bottom 0.152: HCSR04-2.2 36.2,20.85 34.9,22.16 34.9,26.8 v35.9,27.8
TRIG3  (via drill 0.35)
  Top 0.152: v33.3,27.8 35.1,29.6 35.1,43.71 34.05,44.76 34.05,52.05 33.3,52.8 14.78,52.8 U1.D26
  Bottom 0.152: HCSR04-3.2 32.4,21.14 31.23,22.31 31.23,25.73 v33.3,27.8
TRIG4  (via drill 0.35)
  Top 0.152: v30.5,28 31.2,28 33.9,30.7 33.9,43.4 32.9,44.4 32.9,51.4 32.5,51.8 16.32,51.8 U1.D28
  Bottom 0.152: HCSR04-4.2 28.6,21.14 27.44,22.31 27.44,24.93 v30.5,28
TX1  (via drill 0.35)
  Top 0.152: v17.1,35 20.5,38.4 20.5,48.26 21.85,49.61 22.89,49.61 v22.9,49.6 | v22.3,60.2 22.06,60.44 U1.D18
  Bottom 0.152: v22.3,60.2 22.5,60 22.5,56.2 22.9,55.8 v22.9,49.6 | UART1.2 17.11,24.19 v17.11,34.99 v17.1,35
TX2  (via drill 0.35)
  Top 0.152: v19.1,35 21.05,36.95 21.05,48.18 21.78,48.91 23.41,48.91 v23.9,49.4 | v21.5,62.4 20.92,62.98 U1.D16 | v21.5,55.6 21.9,55.2 23.3,55.2 v23.7,55.6
  Bottom 0.152: UART2.2 17.96,20.59 19.18,21.81 19.18,34.92 v19.1,35 | v21.5,62.4 v21.5,55.6 | v23.7,55.6 23.9,55.4 v23.9,49.4
TX3  (via drill 0.35)
  Top 0.152: v21.3,64.8 20.58,65.52 U1.D14
  Bottom 0.152: UART3.2 21.7,15.7 21.7,36 21.15,36.55 21.15,52.32 20.89,52.58 20.89,64.39 v21.3,64.8

### Text on the board
tNames: + | MONSTER DRIVER SHIELD | ARDUINO MEGA PRO | + | - | - | + | - | + | + | A15 | RCJ 2023 SOCCER OPEN | DESIGNED BY VOLTEC | Area for Voltage Sensor | D7 | D10 | D8 | D11 | D9 | D12 | 5V | GND | SDA | SCL | 5V | A0-A3 | RX | TX | GND | 5V | TRIG | - | + | ECHO | GND | A4-A7 | + | - | - | - | + | + | MONSTER DRIVER SHIELD | + | A8-A11 | A12-A15